# Altium schematic sheet sema_1.SchDoc
size A4
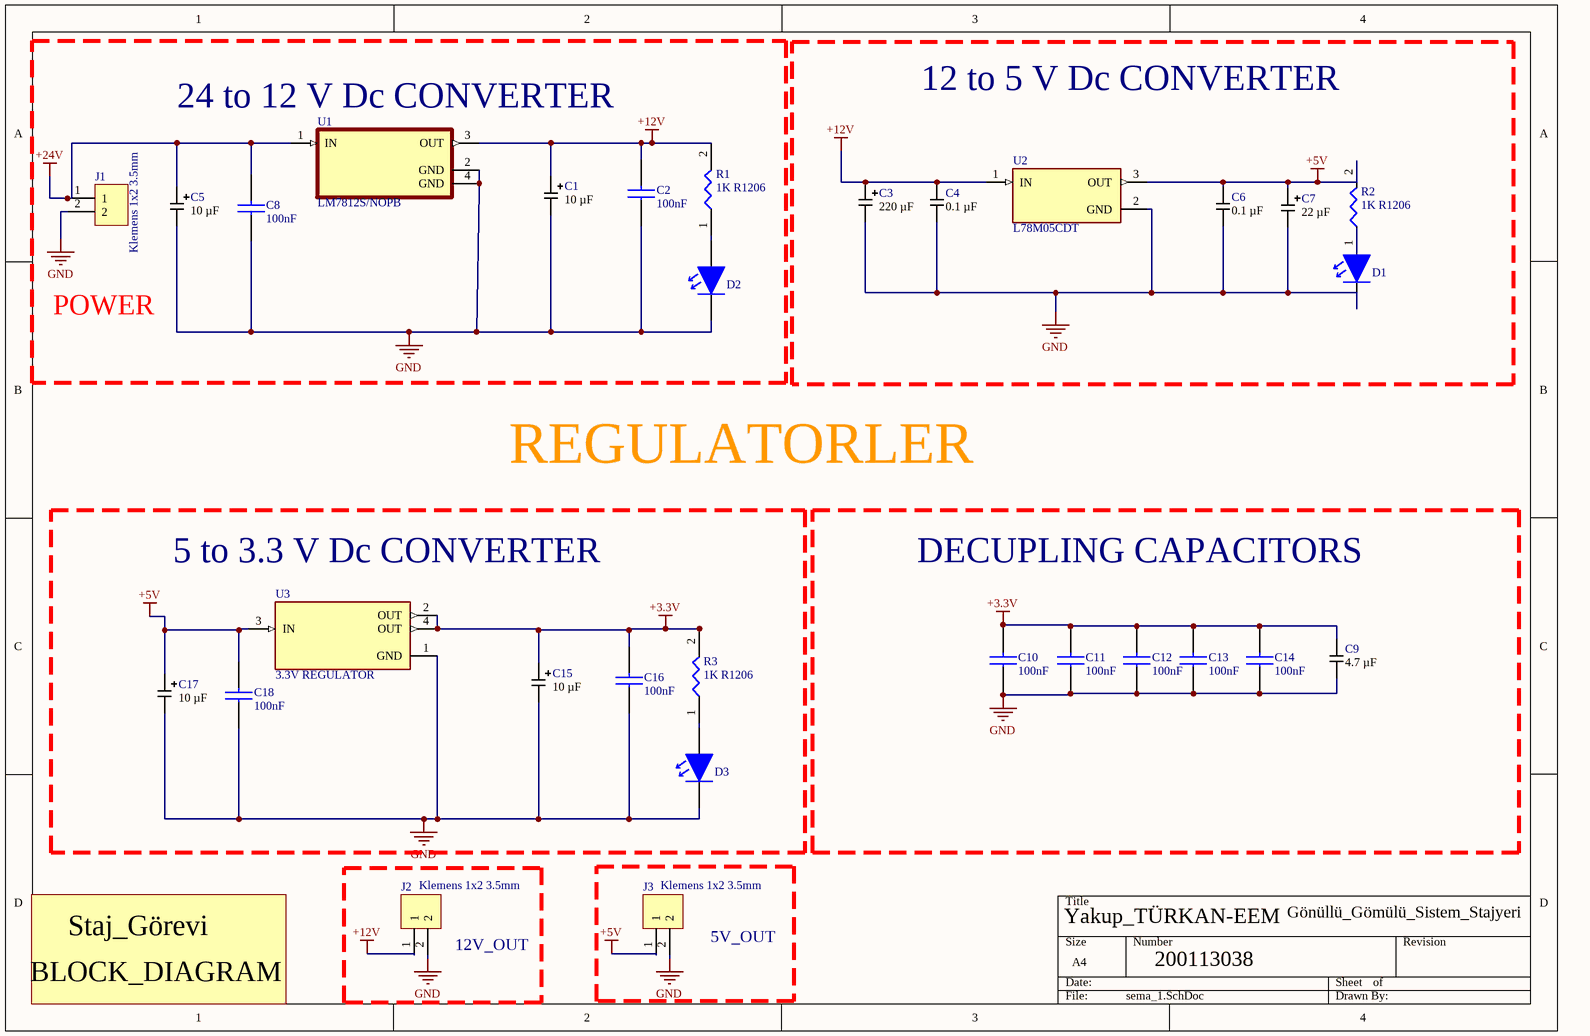
[diagram p0: sema_1.SchDoc]

## Parts
C1  Capacitance: 10 µF  [KEMET_CAP_TAN-B]  (hidden comment: 10uF)
C2  Capacitance: 100nF  [CAP_0603]  (hidden comment: C0603C104K5RACTU)
C3  Capacitance: 220 µF  [KYOCERA_CAP_TAN-C]  (hidden comment: 220uF)
C4  Capacitance: 0.1 µF  [SAMSUNG_CAP_0805_095]  (hidden comment: 0.1uF)
C5  Capacitance: 10 µF  [KEMET_CAP_TAN-B]  (hidden comment: 10uF)
C6  Capacitance: 0.1 µF  [SAMSUNG_CAP_0805_095]  (hidden comment: 0.1uF)
C7  Capacitance: 22 µF  [KEMET_CAP_TAN-B]  (hidden comment: 22uF)
C8  Capacitance: 100nF  [CAP_0603]  (hidden comment: C0603C104K5RACTU)
C9  Capacitance: 4.7 µF  [SAMSUNG_CAP_0805_095]  (hidden comment: 4.7uF)
C10  Capacitance: 100nF  [CAP_0603]  (hidden comment: C0603C104K5RACTU)
C11  Capacitance: 100nF  [CAP_0603]  (hidden comment: C0603C104K5RACTU)
C12  Capacitance: 100nF  [CAP_0603]  (hidden comment: C0603C104K5RACTU)
C13  Capacitance: 100nF  [CAP_0603]  (hidden comment: C0603C104K5RACTU)
C14  Capacitance: 100nF  [CAP_0603]  (hidden comment: C0603C104K5RACTU)
C15  Capacitance: 10 µF  [KEMET_CAP_TAN-B]  (hidden comment: 10uF)
C16  Capacitance: 100nF  [CAP_0603]  (hidden comment: C0603C104K5RACTU)
C17  Capacitance: 10 µF  [KEMET_CAP_TAN-B]  (hidden comment: 10uF)
C18  Capacitance: 100nF  [CAP_0603]  (hidden comment: C0603C104K5RACTU)
D1  LH R974-LP-1  [LED_RED_0805]  (value not drawn)
D2  LH R974-LP-1  [LED_RED_0805]  (value not drawn)
D3  LTST-C171GKT  [LED_GREEN_0805]  (value not drawn)
J1  Klemens 1x2 3.5mm  [Klemens 1x2 - 3.5mm]
J2  Klemens 1x2 3.5mm  [Klemens 1x2 - 3.5mm]
J3  Klemens 1x2 3.5mm  [Klemens 1x2 - 3.5mm]
R1  1K R1206  [R1206 Resıstor]
R2  1K R1206  [R1206 Resıstor]
R3  1K R1206  [R1206 Resıstor]
U1  LM7812S/NOPB  [TO254P1524X483-4N]
U2  L78M05CDT  [VREG_L78M05CDT]
U3  3.3V REGULATOR  [SOT230P700X180-4N]

## Nets
+3.3V: C9.2 C10.2 C11.2 C12.2 C13.2 C14.2 C15.1 C16.2 R3.2 U3.2(OUT) U3.4(OUT)
+5V: C6.2 C7.1 C17.1 C18.2 J3.1 R2.2 U2.3(OUT) U3.3(IN)
+12V: C1.1 C2.2 C3.1 C4.2 J2.1 R1.2 U1.3(OUT) U2.1(IN)
+24V: C5.1 C8.2 J1.1 U1.1(IN)
GND: C1.2 C2.1 C3.2 C4.1 C5.2 C6.1 C7.2 C8.1 C9.1 C10.1 C11.1 C12.1 C13.1 C14.1 C15.2 C16.1 C17.2 C18.1 D1.1 D2.1 D3.1 J1.2 J2.2 J3.2 U1.2(GND) U1.4(GND) U2.2(GND) U3.1(GND)
NetD1_2: D1.2 R2.1
NetD2_2: D2.2 R1.1
NetD3_2: D3.2 R3.1

## Notes on the sheet
- (near U1) 24 to 12 V Dc CONVERTER
- 12 to 5 V Dc CONVERTER
- POWER
- REGULATORLER
- (near U3) 5 to 3.3 V Dc CONVERTER
- DECUPLING CAPACITORS
- Yakup_TÜRKAN-EEM
- Gönüllü_Gömülü_Sistem_Stajyeri
- BLOCK_DIAGRAM
- Staj_Görevi
- (near J2) 12V_OUT
- (near J3) 5V_OUT
- 200113038

## Library data of the parts
C1 C5 C15 C17 = 10uF: CAP TANT 10UF 20% 16V 1411; Supplier 1: Digi-Key; Supplier 2: Farnell; Supplier 3: Mouser; Supplier Part Number 1: 399-3708-1-ND; Supplier Part Number 2: 2462772; Supplier Part Number 3: 80-T491B106M016
C2 C8 C10-C14 C16 C18 = CAP CER 100nF 0603: CAP CER 100nF %10 0603 SMD; Manufacturer: KEMET; Designed by: BERK; Dielectric Material: Ceramic; Voltage Rating (DC): 50V; Tolerance: 10%; Dielectric: X7R; Dissipation Factor: 2.5%; Supplier 1: Digi-Key; Manufacturer Part Number: C0603C104K5RACTU; RoHS: Yes; Category: Ceramic Capacitors; Stock 1: 1666186; Pricing 1: 1=0,12000, 10=0,08500, 50=0,04620, 100=0,03770, 500=0,02696, 1000=0,02118 (USD); Mount: Surface Mount; Case/Package: 0603; Number of Pins: 2; Case Code (Metric): 1608; Case Code (Imperial): 0603; Contact Plating: Tin,Matte; Min Operating Temperature: -55°C; Max Operating Temperature: 125°C; Packaging: Tape and Reel; Package Quantity: 1; Termination: SMD/SMT; Voltage: 50V; Voltage Rating: 50V; Series: SMD Comm X7R; Length: 0.063inch; Width: 0.031inch; Height: 0.8mm; Thickness: 0.034inch; Lead Pitch: 0.7mm; Depth: 0.8mm; Radiation Hardening: No; RoHS Compliant: Yes; REACH SVHC: No SVHC; ComponentLink1URL: https://datasheet.ciiva.com/7823/kem-c1002-x7r-smd-7823591.pdf?src-supplier=Element14; ComponentLink1Description: https://datasheet.ciiva.com/7823/kem-c1002-x7r-smd-7823591.pdf?src-supplier=Element14; ComponentLink2URL: https://datasheet.ciiva.com/14602/70095383-14602583.pdf?src-supplier=Allied+Electronics; ComponentLink2Description: https://datasheet.ciiva.com/14602/70095383-14602583.pdf?src-supplier=Allied+Electronics; ComponentLink3URL: https://datasheet.ciiva.com/5999/kem-c1002-x7r-smd-5999400.pdf?src-supplier=Farnell; ComponentLink3Description: https://datasheet.ciiva.com/5999/kem-c1002-x7r-smd-5999400.pdf?src-supplier=Farnell; ComponentLink4URL: https://datasheet.ciiva.com/7823/kem-c1002-x7r-smd-7823592.pdf?src-supplier=Element14; ComponentLink4Description: https://datasheet.ciiva.com/7823/kem-c1002-x7r-smd-7823592.pdf?src-supplier=Element14; ComponentLink5URL: https://datasheet.ciiva.com/28645/1851736-28645640.pdf?src-supplier=Element14; ComponentLink5Description: https://datasheet.ciiva.com/28645/1851736-28645640.pdf?src-supplier=Element14; ComponentLink6URL: https://datasheet.ciiva.com/14585/70095383-14585209.pdf?src-supplier=Allied+Electronics; ComponentLink6Description: https://datasheet.ciiva.com/14585/70095383-14585209.pdf?src-supplier=Allied+Electronics; Supplier Part Number 1: 399-5089-1-ND
C3 = 220uF: CAP TANT 220UF 20% 10V 2312; Supplier 1: Digi-Key; Supplier 2: Mouser; Supplier 3: Arrow Electronics; Supplier Part Number 3: TAJC227M010RNJ; Supplier Part Number 2: 581-TAJC227M010RNJ; Supplier Part Number 1: 478-8899-1-ND
C4 C6 = 0.1uF: CAP CER 0.1UF 25V X7R 0805; Supplier 1: Digi-Key; Supplier 2: Farnell; Supplier 3: Mouser; Supplier Part Number 1: 1276-1099-1-ND; Supplier Part Number 2: 3013475; Supplier Part Number 3: 187-CL21B104KACNNNC
C7 = 22uF: CAP TANT 22UF 10% 20V 1411; Supplier 1: Digi-Key; Supplier 2: Farnell; Supplier 3: Mouser; Supplier Part Number 1: 399-5296-1-ND; Supplier Part Number 2: 2321214; Supplier Part Number 3: 80-T491B226K020AT
C9 = 4.7uF: CAP CER 4.7UF 25V X5R 0805; Supplier 1: Digi-Key; Supplier 2: Mouser; Supplier 3: Arrow Electronics; Supplier Part Number 1: 1276-2415-1-ND; Supplier Part Number 2: 187-CL21A475KACLRNC; Supplier Part Number 3: CL21A475KACLRNC
D1 D2 = LED RED 0805: LED Uni-Color Hyper Red 660nm 2-Pin Chip 0805(2012Metric) T/R; Manufacturer: Osram Opto; Lens Color: White; Forward Voltage: 1.8V; Lens Style: Diffused,Flat,Colorless; Luminous Intensity: 71mcd; Viewing Angle: 160°; Forward Current: 30mA; Dominant Wavelength: 645nm; Number of Elements: 1; Test Current: 20mA; Reverse Voltage: 5V; Lens Transparency: Diffused; Luminous Flux: 0.17lm; Lens Size: 1.25mm; Designed by: BERK; Supplier 1: Digi-Key; Manufacturer Part Number: LH R974-LP-1; RoHS: Yes; Category: LEDs; Stock 1: 35632; Pricing 1: 1=0,26000, 10=0,13900, 100=0,06480, 500=0,05978, 1000=0,04683, 2000=0,04584 (USD); Mount: Surface Mount; Case/Package: 0805; Number of Pins: 2; Color: Red; Case Code (Imperial): 0805; Case Code (Metric): 2012; Min Operating Temperature: -30°C; Max Operating Temperature: 85°C; Packaging: Tape and Reel; Illumination Color: Red; Package Quantity: 1; Series: CHipLED; Length: 2.1mm; Width: 1.25mm; Depth: 1.35mm; Radiation Hardening: No; RoHS Compliant: Yes; ComponentLink1URL: http://www.jameco.com/Jameco/Products/ProdDS/2085634.pdf?src-supplier=Jameco; ComponentLink1Description: http://www.jameco.com/Jameco/Products/ProdDS/2085634.pdf?src-supplier=Jameco; ComponentLink2URL: http://components.arrow.com/part/dataview/0323_01825492?src-supplier=Arrow+Europe; ComponentLink2Description: http://components.arrow.com/part/dataview/0323_01825492?src-supplier=Arrow+Europe; ComponentLink3URL: https://dammedia.osram.info/media/resource/hires/osram-dam-2493888/LH%20R974.pdf?src-supplier=Digi-Key; ComponentLink3Description: https://dammedia.osram.info/media/resource/hires/osram-dam-2493888/LH%20R974.pdf?src-supplier=Digi-Key; ComponentLink4URL: http://www.mouser.com/ds/2/311/LH%20R974%20-%20CHIPLED%200805-318659.pdf?src-supplier=Mouser; ComponentLink4Description: http://www.mouser.com/ds/2/311/LH%20R974%20-%20CHIPLED%200805-318659.pdf?src-supplier=Mouser; ComponentLink5URL: https://www.verical.com/server-webapp/html/getDatasheet?partID=258950&src-supplier=Verical; ComponentLink5Description: https://www.verical.com/server-webapp/html/getDatasheet?partID=258950&src-supplier=Verical; ComponentLink6URL: http://components.arrow.com/part/dataview/41971690S1077610N9133?src-supplier=Arrow+Electronics; ComponentLink6Description: http://components.arrow.com/part/dataview/41971690S1077610N9133?src-supplier=Arrow+Electronics; ComponentLink7URL: http://components.arrow.com/part/dataview/41971690S6190115N2128?src-supplier=Arrow+Electronics; ComponentLink7Description: http://components.arrow.com/part/dataview/41971690S6190115N2128?src-supplier=Arrow+Electronics; Supplier Part Number 1: 475-1415-1-ND
D3 = LED GREEN 0805: Green 0805 130 º Min 5 mcd Typical 12 mcd Water Clear Lens SMT LED; Manufacturer: Vishay Lite-On; Designed by: BERK; Lens Color: Colorless; Viewing Angle: 130°; Lens Style: Diffused,Colorless,Rectangular,Clear; Luminous Intensity: 12mcd; Forward Current: 30mA; Forward Voltage: 2.1V; Power Rating: 100mW; Dominant Wavelength: 569nm; Test Current: 10mA; Number of Elements: 1; Wavelength: 585nm; Reverse Voltage: 5V; Supplier 1: Digi-Key; Manufacturer Part Number: LTST-C171GKT; RoHS: Yes; Category: LEDs; Stock 1: 159023; Pricing 1: 1=0,26000, 10=0,14100, 100=0,06560, 500=0,06060, 1000=0,04747 (USD); Mount: Surface Mount; Case/Package: 0805; Number of Pins: 2; Color: Green; Case Code (Metric): 2012; Case Code (Imperial): 0805; Min Operating Temperature: -55°C; Max Operating Temperature: 85°C; Package Quantity: 1; Packaging: Tape and Reel; Illumination Color: Green; Lens Transparency: Clear; Power Dissipation: 100mW; Number of LEDs: 1; Series: CHIPLED 0805; Length: 2mm; Width: 1.25mm; Height: 0.8mm; Depth: 1.25mm; Radiation Hardening: No; Lead Free: Lead Free; RoHS Compliant: Yes; ComponentLink1URL: https://datasheet.ciiva.com/2110/ltst-c171gkt-2110000.pdf?src-supplier=Digi-Key; ComponentLink1Description: https://datasheet.ciiva.com/2110/ltst-c171gkt-2110000.pdf?src-supplier=Digi-Key; ComponentLink2URL: https://datasheet.ciiva.com/11773/0900766b80dc0296-11773991.pdf?src-supplier=RSComponents; ComponentLink2Description: https://datasheet.ciiva.com/11773/0900766b80dc0296-11773991.pdf?src-supplier=RSComponents; ComponentLink3URL: https://datasheet.ciiva.com/12400/lite-on-ltst-c171gkt-190133-12400647.pdf?src-supplier=Mouser; ComponentLink3Description: https://datasheet.ciiva.com/12400/lite-on-ltst-c171gkt-190133-12400647.pdf?src-supplier=Mouser; ComponentLink4URL: https://datasheet.ciiva.com/2110/ltst-c171gkt-2110001.pdf?src-supplier=Digi-Key; ComponentLink4Description: https://datasheet.ciiva.com/2110/ltst-c171gkt-2110001.pdf?src-supplier=Digi-Key; ComponentLink5URL: https://datasheet.ciiva.com/2110/ltst-c171gkt-2110002.pdf?src-supplier=Digi-Key; ComponentLink5Description: https://datasheet.ciiva.com/2110/ltst-c171gkt-2110002.pdf?src-supplier=Digi-Key; ComponentLink6URL: https://datasheet.ciiva.com/16396/ltst-c171gkt-16396549.pdf?src-supplier=Future+Electronics; ComponentLink6Description: https://datasheet.ciiva.com/16396/ltst-c171gkt-16396549.pdf?src-supplier=Future+Electronics; Supplier Part Number 1: 160-1423-1-ND
U1 = LM7812S/NOPB: MF: {'manufacturer': u'Texas Instruments'}; Availability: Unavailable; MP: LM7812S/NOPB; Value: *; Price: None; Package: None
U2 = L78M05CDT: Linear Voltage Regulator IC 1 Output 500mA DPAK; MF: {'manufacturer': u'STMicroelectronics'}; Availability: Unavailable; MP: L78M05CDT; Price: None; Value: *; Package: None
U3 = 3.3V REGULATOR: LDO Voltage Regulators 3.3V 0.8A Positive; MP: LD1117S33TR; MF: {'manufacturer': u'STMicroelectronics'}; Package: None; Availability: Unavailable; Value: *; Price: None